# Altium schematic sheet Revision history.SchDoc: Name project title here
size A3; Organization: Krakul OÜ; Address1: Kaare tee 3, lubja; Address2: viimsi vald; Address3: harju maakond; Address4: Estonia 74010; DocumentNumber: No here; Revision: 0; SheetNumber: 7; SheetTotal: 7
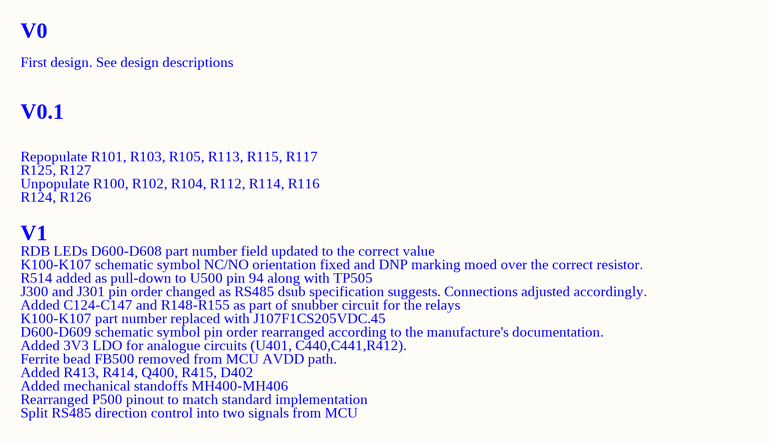
[diagram p0: Revision history.SchDoc]

## Notes on the sheet
- V0
- First design. See design descriptions
- V0.1
- Repopulate R101, R103, R105, R113, R115, R117
- R125, R127
- Unpopulate R100, R102, R104, R112, R114, R116
- R124, R126
- RDB LEDs D600-D608 part number field updated to the correct value
- V1
- K100-K107 schematic symbol NC/NO orientation fixed and DNP marking moed over the correct resistor.
- R514 added as pull-down to U500 pin 94 along with TP505
- J300 and J301 pin order changed as RS485 dsub specification suggests. Connections adjusted accordingly.
- Added C124-C147 and R148-R155 as part of snubber circuit for the relays
- K100-K107 part number replaced with J107F1CS205VDC.45
- D600-D609 schematic symbol pin order rearranged according to the manufacture's documentation.
- Added 3V3 LDO for analogue circuits (U401, C440,C441,R412).
- Ferrite bead FB500 removed from MCU AVDD path.
- Added R413, R414, Q400, R415, D402
- Added mechanical standoffs MH400-MH406
- Rearranged P500 pinout to match standard implementation
- Split RS485 direction control into two signals from MCU
- Title:
- Date:
- Last modified:
- Project:
- Sheet
- Time:
- of
- Size:
- A3
- Engineer:
- Revision:
- Revision date:
- Checked by: